# EAGLE design usb-dongle (EAGLE 6.6.0)
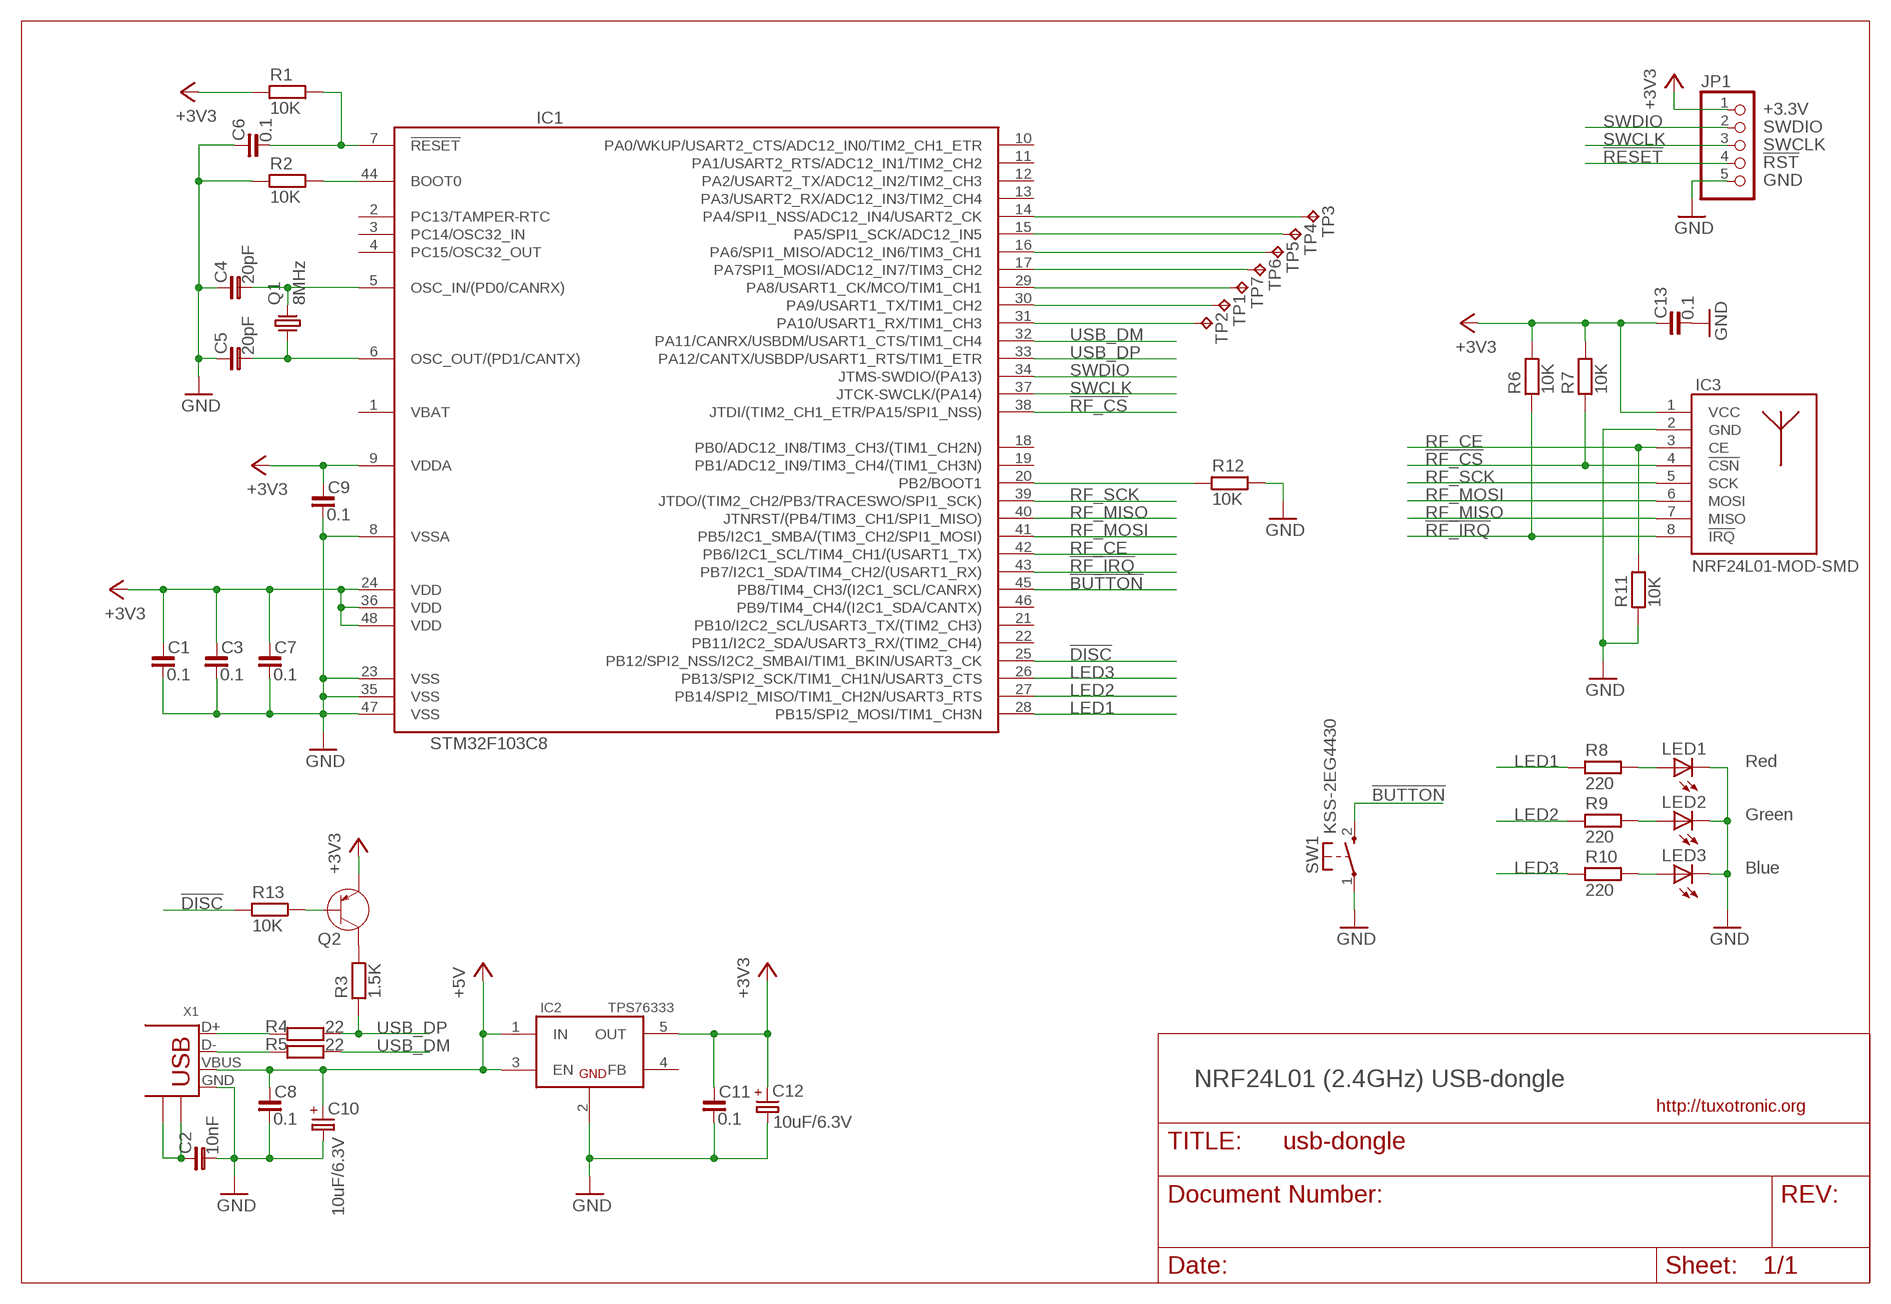
[diagram p0: schematic, sheet 1]

## Parts
C1  0.1  C_0603  [C0603]
C2  10nF  C_1206  [C1206]
C3  0.1  C_0603  [C0603]
C4  20pF  C_0603  [C0603]
C5  20pF  C_0603  [C0603]
C6  0.1  C_0603  [C0603]
C7  0.1  C_0603  [C0603]
C8  0.1  C_0603  [C0603]
C9  0.1  C_0603  [C0603]
C10  10uF/6.3V  CP_SMCB  [SMC_B]
C11  0.1  C_0603  [C0603]
C12  10uF/6.3V  CP_SMCB  [SMC_B]
C13  0.1  C_0603  [C0603]
IC1  STM32F103C8  [LQFP48]
IC2  TPS76333  [SOT23-5]
IC3  NRF24L01-MOD-SMD  [SMD8-MODULE]
JP1  SWD-5_2.00  [1X05M]
LED1  LEDCHIPLED_0805  [CHIPLED_0805]
LED2  LEDCHIPLED_0805  [CHIPLED_0805]
LED3  LEDCHIPLED_0805  [CHIPLED_0805]
Q1  8MHz  CRYSTAL-HC49S  [HC49/S]
Q2  PNP-SOT23  [SOT23]
R1  10K  R_0603  [R0603]
R2  10K  R_0603  [R0603]
R3  1.5K  R_0603  [R0603]
R4  22  R_0603  [R0603]
R5  22  R_0603  [R0603]
R6  10K  R_0603  [R0603]
R7  10K  R_0603  [R0603]
R8  220  R_0603  [R0603]
R9  220  R_0603  [R0603]
R10  220  R_0603  [R0603]
R11  10K  R_0603  [R0603]
R12  10K  R_0603  [R0603]
R13  10K  R_0603  [R0603]
SW1  KSS-2EG4430  [KSS-2EG4430]
TP1  TPB1,27  [B1,27]
TP2  TPB1,27  [B1,27]
TP3  TPB1,27  [B1,27]
TP4  TPB1,27  [B1,27]
TP5  TPB1,27  [B1,27]
TP6  TPB1,27  [B1,27]
TP7  TPB1,27  [B1,27]
X1  USB-MALE-A-H  [USB-A-MH]

## Nets
!BUTTON: IC1.45(PB8/TIM4_CH3/(I2C1_SCL/CANRX)) SW1.2(S)
!DISC: IC1.25(PB12/SPI2_NSS/I2C2_SMBAI/TIM1_BKIN/USART3_CK) R13.1
!RESET: C6.2 IC1.7(!RESET) JP1.4 R1.2
!RF_CS: IC1.38(JTDI/(TIM2_CH1_ETR/PA15/SPI1_NSS)) IC3.4(!CSN) R7.1
!RF_IRQ: IC1.43(PB7/I2C1_SDA/TIM4_CH2/(USART1_RX)) IC3.8(!IRQ) R6.1
+3V3: C1.1 C3.1 C7.1 C9.1 C11.1 C12.+ C13.1 IC1.9(VDDA) IC1.24(VDD) IC1.36(VDD) IC1.48(VDD) IC2.5(OUT) IC3.1(VCC) JP1.1 Q2.2(E) R1.1 R6.2 R7.2
+5V: C8.1 C10.+ IC2.1(IN) IC2.3(EN) X1.VBUS
GND: C1.2 C2.2 C3.2 C4.1 C5.1 C6.1 C7.2 C8.2 C9.2 C10.- C11.2 C12.- C13.2 IC1.8(VSSA) IC1.23(VSS) IC1.35(VSS) IC1.47(VSS) IC2.2(GND) IC3.2(GND) JP1.5 LED1.C LED2.C LED3.C R2.1 R11.1 R12.2 SW1.1(P) X1.GND
LED1: IC1.28(PB15/SPI2_MOSI/TIM1_CH3N) R8.1
LED2: IC1.27(PB14/SPI2_MISO/TIM1_CH2N/USART3_RTS) R9.1
LED3: IC1.26(PB13/SPI2_SCK/TIM1_CH1N/USART3_CTS) R10.1
N$1: C2.1 X1.P$5 X1.P$6
N$2: R4.1 X1.D+
N$3: R5.1 X1.D-
N$4: IC1.30(PA9/USART1_TX/TIM1_CH2) TP1.PP(TP)
N$5: IC1.31(PA10/USART1_RX/TIM1_CH3) TP2.PP(TP)
N$6: C4.2 IC1.5(OSC_IN/(PD0/CANRX)) Q1.2
N$7: C5.2 IC1.6(OSC_OUT/(PD1/CANTX)) Q1.1
N$8: LED1.A R8.2
N$9: LED2.A R9.2
N$10: LED3.A R10.2
N$11: IC1.44(BOOT0) R2.2
N$12: IC1.14(PA4/SPI1_NSS/ADC12_IN4/USART2_CK) TP3.PP(TP)
N$13: IC1.15(PA5/SPI1_SCK/ADC12_IN5) TP4.PP(TP)
N$14: IC1.16(PA6/SPI1_MISO/ADC12_IN6/TIM3_CH1) TP5.PP(TP)
N$15: IC1.17(PA7SPI1_MOSI/ADC12_IN7/TIM3_CH2) TP6.PP(TP)
N$16: IC1.29(PA8/USART1_CK/MCO/TIM1_CH1) TP7.PP(TP)
N$17: IC1.20(PB2/BOOT1) R12.1
N$18: Q2.1(B) R13.2
N$19: Q2.3(C) R3.2
RF_CE: IC1.42(PB6/I2C1_SCL/TIM4_CH1/(USART1_TX)) IC3.3(CE) R11.2
RF_MISO: IC1.40(JTNRST/(PB4/TIM3_CH1/SPI1_MISO)) IC3.7(MISO)
RF_MOSI: IC1.41(PB5/I2C1_SMBA/(TIM3_CH2/SPI1_MOSI)) IC3.6(MOSI)
RF_SCK: IC1.39(JTDO/(TIM2_CH2/PB3/TRACESWO/SPI1_SCK)) IC3.5(SCK)
SWCLK: IC1.37(JTCK-SWCLK/(PA14)) JP1.3
SWDIO: IC1.34(JTMS-SWDIO/(PA13)) JP1.2
USB_DM: IC1.32(PA11/CANRX/USBDM/USART1_CTS/TIM1_CH4) R5.2
USB_DP: IC1.33(PA12/CANTX/USBDP/USART1_RTS/TIM1_ETR) R3.1 R4.2
Unconnected: IC1.2(PC13/TAMPER-RTC) IC1.3(PC14/OSC32_IN) IC1.4(PC15/OSC32_OUT) IC1.10(PA0/WKUP/USART2_CTS/ADC12_IN0/TIM2_CH1_ETR) IC1.11(PA1/USART2_RTS/ADC12_IN1/TIM2_CH2) IC1.12(PA2/USART2_TX/ADC12_IN2/TIM2_CH3) IC1.13(PA3/USART2_RX/ADC12_IN3/TIM2_CH4) IC1.18(PB0/ADC12_IN8/TIM3_CH3/(TIM1_CH2N)) IC1.19(PB1/ADC12_IN9/TIM3_CH4/(TIM1_CH3N)) IC1.21(PB10/I2C2_SCL/USART3_TX/(TIM2_CH3)) IC1.22(PB11/I2C2_SDA/USART3_RX/(TIM2_CH4)) IC1.46(PB9/TIM4_CH4/(I2C1_SDA/CANTX)) IC2.4(FB)

## Notes on the sheet
- Red
- Green
- Blue
- NRF24L01 (2.4GHz) USB-dongle

## Power pins joined to a net without a drawn wire
VBAT: IC1.1(VBAT)

## Library data of the parts
C1-C9 C11 C13 = rc-master-smd:C_: NON-POLARIZED CAP
C10 C12 = rc-master-smd:CP_: POLARIZED CAP
IC1 = stm32:STM32F103C
IC2 = vreg-linear:TPS763: TPS763xx: Low-Power 150-mA Low-Dropout Linear Regulators
IC3 = nrf24l01:NRF24L01-MOD: NRF24L01 based module VCC = 1.9~3.6V
JP1 = jtag:SWD-5: PIN HEADER
LED1-LED3 = led:LED: LED OSRAM: - CHIPLED LG R971, LG N971, LY N971, LG Q971, LY Q971, LO R971, LY R971 LH N974, LH R974 LS Q976, LO Q976, LY Q976 LO Q996 - Hyper CHIPLED LW Q18S LB Q993, LB Q99A, LB R99A - SideLED LS A670, LO A670, LY A670, LG A670, LP A670 LB A673, LV A673, LT A673, LW A673 LH A674 LY A675 LS A676, LA A676, LO A676, LY A676, LW A676 LS A679, LY A679, LG A679 - Hyper Micro SIDELED® LS Y876, LA Y876, LO Y876, LY Y876 LT Y87S - SmartLED LW L88C, LW L88S LB L89C, LB L89S, LG L890 LS L89K, LO L89K, LY L89K LS L896, LA L896, LO L896, LY L896 - TOPLED LS T670, LO T670, LY T670, LG T670, LP T670 LSG T670, LSP T670, LSY T670, LOP T670, LYG T670 LG T671, LOG T671, LSG T671 LB T673, LV T673, LT T673, LW T673 LH T674 LS T676, LA T676, LO T676, LY T676, LB T676, LH T676, LSB T676, LW T676 LB T67C, LV T67C, LT T67C, LS T67K, LO T67K, LY T67K, LW E67C LS E67B, LA E67B, LO E67B, LY E67B, LB E67C, LV E67C, LT E67C LW T67C LS T679, LY T679, LG T679 LS T770, LO T770, LY T770, LG T770, LP T770 LB T773, LV T773, LT T773, LW T773 LH T774 LS E675, LA E675, LY E675, LS T675 LS T776, LA T776, LO T776, LY T776, LB T776 LHGB T686 LT T68C, LB T68C - Hyper Mini TOPLED® LB M676 - Mini TOPLED Santana® LG M470 LS M47K, LO M47K, LY M47K Source: http://www.osram.convergy.de - LUMILED® LXK2-PW12-R00, LXK2-PW12-S00, LXK2-PW14-U00, LXK2-PW14-V00 LXK2-PM12-R00, LXK2-PM12-S00, LXK2-PM14-U00 LXK2-PE12-Q00, LXK2-PE12-R00, LXK2-PE12-S00, LXK2-PE14-T00, LXK2-PE14-U00 LXK2-PB12-K00, LXK2-PB12-L00, LXK2-PB12-M00, LXK2-PB14-N00, LXK2-PB14-P00, LXK2-PB14-Q00 LXK2-PR12-L00, LXK2-PR12-M00, LXK2-PR14-Q00, LXK2-PR14-R00 LXK2-PD12-Q00, LXK2-PD12-R00, LXK2-PD12-S00 LXK2-PH12-R00, LXK2-PH12-S00 LXK2-PL12-P00, LXK2-PL12-Q00, LXK2-PL12-R00 Source: www.luxeon.com
Q1 = crystal:CRYSTAL-: CRYSTAL
Q2 = semiconductor:PNP-
R1-R13 = rc-master-smd:R_: RESISTOR
SW1 = buttons:KSS-2EG4430: Size: 3x6mm Height: 5mm from PCB Rating: DC12v 50mA Travel: 0.25±0.10mm Operating Force: 180±50gf Return Force: 60gf min Contact resistance: 100m? max Insulation resistance: 100M? min Operating life?50,000 cycles
TP1-TP7 = testpad:TP: Test pad
X1 = usb:USB-MALE

## Board
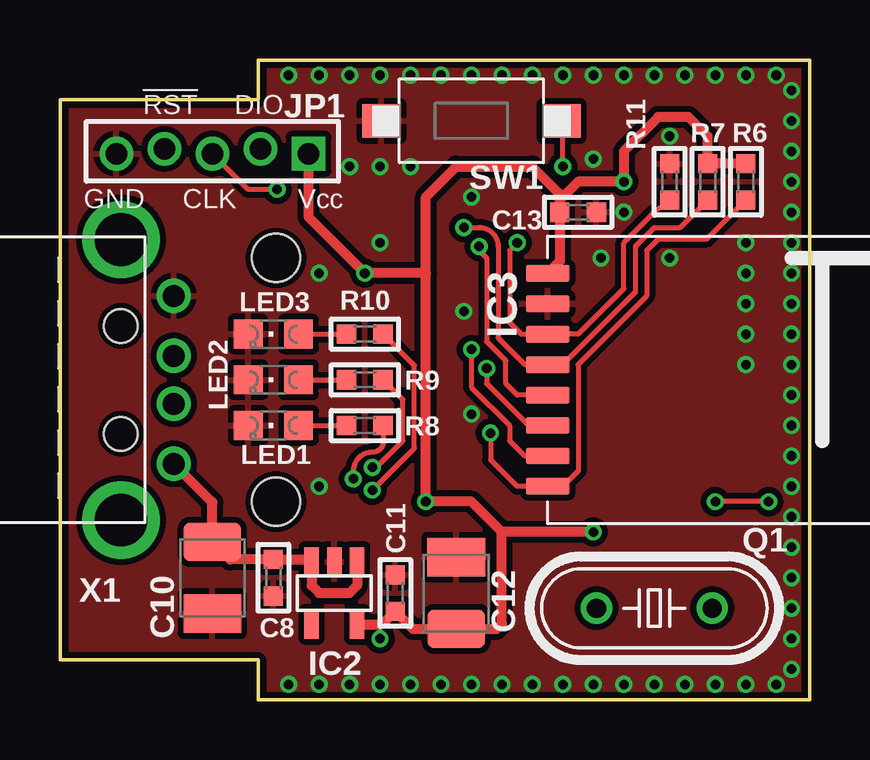
[diagram p1: board, top side]
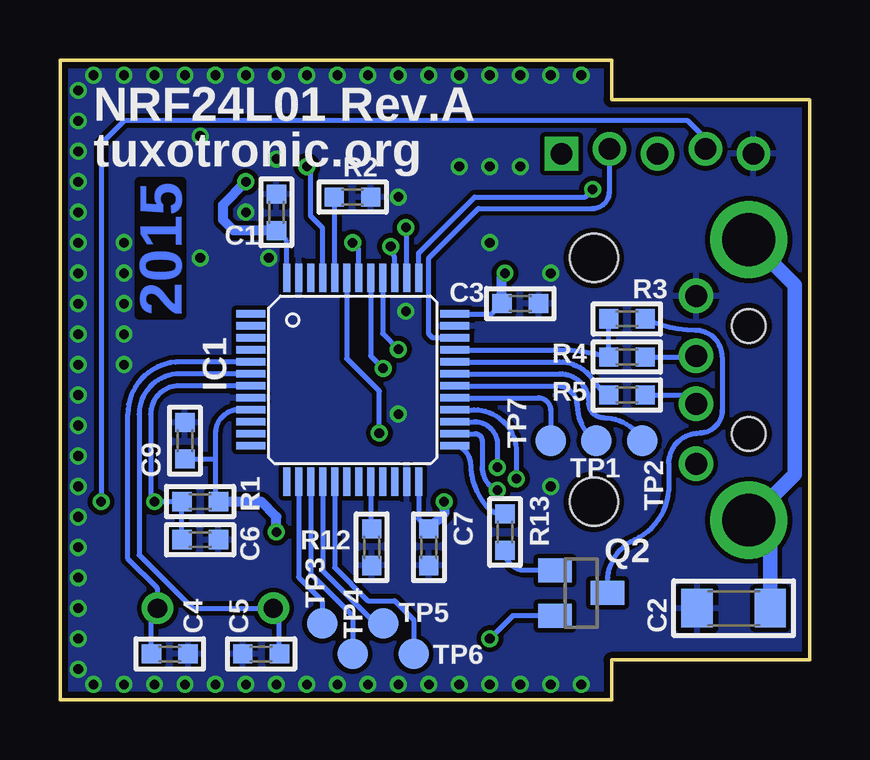
[diagram p2: board, bottom side, seen from below]

Size 31.24 x 26.67 mm. Coordinates in mm from the lower left corner, seen from the top.
Outline: 8.26,0 31.24,0 31.24,26.67 8.26,26.67 8.26,25.02 0,25.02 0,1.65 8.26,1.65 8.26,0
Copper layers (1*16): Top 0.035mm / dielectric 1.5mm / Bottom 0.035mm
Design rules "ITEADstudio_DRC": minimum track width 6mil, minimum drill 12mil, track to track 6mil, track to pad 6mil, pad to pad 6mil, via to via 6mil, smd to smd 0mil, copper to edge 10mil, drill to drill 10mil, minimum pad ring 10mil, minimum via ring 6mil, stop-mask expansion 2mil, vias tented up to drill 100mil, thermal gap 10mil
Holes 2 mm at 9,18.41 9,8.26

### Footprints (pad centres in the part's own frame; a part is rotated, then mirrored left to right if it is on the bottom)
C0603 = smd 0.8 x 0.8: 1 -0.762,0; 2 0.762,0
C1206 = smd 1.3 x 1.6: 1 -1.524,0; 2 1.524,0
SMC_B = smd 1.6 x 2.4: + -1.5,0; - 1.5,0
LQFP48 = smd 0.3 x 1.2: 1 -2.75,-4.25; 2 -2.25,-4.25; 3 -1.75,-4.25; 4 -1.25,-4.25; 5 -0.75,-4.25; 6 -0.25,-4.25; 7 0.25,-4.25; 8 0.75,-4.25; 9 1.25,-4.25; 10 1.75,-4.25; 11 2.25,-4.25; 12 2.75,-4.25; 25 2.75,4.25; 26 2.25,4.25; 27 1.75,4.25; 28 1.25,4.25; 29 0.75,4.25; 30 0.25,4.25; 31 -0.25,4.25; 32 -0.75,4.25; 33 -1.25,4.25; 34 -1.75,4.25; 35 -2.25,4.25; 36 -2.75,4.25 | smd 1.2 x 0.3: 13 4.25,-2.75; 14 4.25,-2.25; 15 4.25,-1.75; 16 4.25,-1.25; 17 4.25,-0.75; 18 4.25,-0.25; 19 4.25,0.25; 20 4.25,0.75; 21 4.25,1.25; 22 4.25,1.75; 23 4.25,2.25; 24 4.25,2.75; 37 -4.25,2.75; 38 -4.25,2.25; 39 -4.25,1.75; 40 -4.25,1.25; 41 -4.25,0.75; 42 -4.25,0.25; 43 -4.25,-0.25; 44 -4.25,-0.75; 45 -4.25,-1.25; 46 -4.25,-1.75; 47 -4.25,-2.25; 48 -4.25,-2.75
SOT23-5 = smd 0.6 x 1.2: 1 -0.95,-1.306; 2 0,-1.306; 3 0.95,-1.306; 4 0.95,1.306; 5 -0.95,1.306
SMD8-MODULE = smd 0.7 x 1.8: 1 -4.445,0; 2 -3.175,0; 3 -1.905,0; 4 -0.635,0; 5 0.635,0; 6 1.905,0; 7 3.175,0; 8 4.445,0
1X05M = drill 0.9 square: 1 -4,0.102 | drill 0.9: 2 -2,-0.102; 3 0,0.102; 4 2,-0.102; 5 4,0.102
CHIPLED_0805 = smd 1.2 x 1.2: A 0,-1.05; C 0,1.05
HC49/S = drill 0.8: 1 -2.413,0; 2 2.413,0
SOT23 = smd 1 x 1.4: 1 -0.95,-1.1; 2 0.95,-1.1; 3 0,1.1
R0603 = smd 0.8 x 0.8: 1 -0.762,0; 2 0.762,0
KSS-2EG4430 = smd 1.6 x 1.4: 1 -3.75,0; 2 3.75,0
B1,27 = smd 1.27 x 1.27: PP 0,0
USB-A-MH = drill 0.92: D+ 2.2,1; D- 2.2,-1; GND 2.2,3.5; VBUS 2.2,-3.5 | drill 2.2: P$5 0,-5.85; P$6 0,5.85 | hole 1.4: 0,2.25; 0,-2.25

### Placement (x,y rotation side)
C1  22.23,20.32 90 bottom
C2  3.17,3.81 180 bottom
C3  12.06,16.51 0 bottom
C4  26.67,1.91 180 bottom
C5  22.86,1.91 0 bottom
C6  25.4,6.67 180 bottom
C7  15.88,6.35 270 bottom
C8  8.89,5.08 270 top
C9  26.04,10.79 90 bottom
C10  6.35,5.08 270 top
C11  13.97,4.45 90 top
C12  16.51,4.45 90 top
C13  21.59,20.32 0 top
IC1  19.05,13.34 270 bottom
IC2  11.43,4.45 180 top
IC3  20.32,13.34 270 top
JP1  6.35,22.86 180 top
LED1  8.89,11.43 90 top
LED2  8.89,13.34 90 top
LED3  8.89,15.24 90 top
Q1  24.77,3.81 0 top
Q2  9.53,4.45 270 bottom
R1  25.4,8.26 180 bottom
R2  19.05,20.95 180 bottom
R3  7.62,15.88 0 bottom
R4  7.62,14.29 180 bottom
R5  7.62,12.7 180 bottom
R6  28.57,21.59 90 top
R7  26.99,21.59 90 top
R8  12.7,11.43 180 top
R9  12.7,13.34 180 top
R10  12.7,15.24 180 top
R11  25.4,21.59 270 top
R12  18.26,6.35 270 bottom
R13  12.7,6.99 270 bottom
SW1  17.14,24.13 0 top
TP1  8.89,10.79 0 bottom
TP2  6.99,10.79 180 bottom
TP3  20.32,3.17 0 bottom
TP4  19.05,1.91 0 bottom
TP5  17.78,3.17 0 bottom
TP6  16.51,1.91 180 bottom
TP7  10.79,10.79 0 bottom
X1  2.54,13.34 0 top

### Tracks (layer width: path | path; a pad name or v marks a point on that pad's centre or on a via)
!BUTTON  (via drill 0.4)
  Top 0.2: v20.95,22.23 20.95,24.07 SW1.2
  Bottom 0.2: IC1.45 20.3,19.66 20.8,20.16 20.8,22.07 v20.95,22.23
!DISC
  Bottom 0.2: R13.1 arc55 13.34,7.94 arc46 14.13,9.81 arc-82 IC1.25
!RESET  (via drill 0.4)
  Top 0.2: v29.53,8.26 v27.3,8.26
  Bottom 0.2: IC1.7 26.29,13.09 arc-90 27.46,11.91 27.46,8.41 v27.3,8.26 R1.2 C6.2 | JP1.4 4.35,23.4 5.08,24.13 28.57,24.13 29.53,23.18 v29.53,8.26
!RF_CS  (via drill 0.4)
  Top 0.2: v16.83,19.68 17.46,19.68 arc-90 18.26,18.89 18.26,15.08 19.37,13.97 IC3.4 20.95,13.97 23.97,16.99 23.97,18.89 24.77,19.68 25.84,19.68 R7.1
  Bottom 0.2: IC1.38 16.8,19.34 v16.83,19.68
!RF_IRQ  (via drill 0.4)
  Top 0.2: v17.94,11.11 17.94,10 19.05,8.89 IC3.8 20.95,8.89 21.59,9.53 21.59,13.97 24.45,16.83 24.45,18.73 24.92,19.21 26.96,19.21 R6.1
  Bottom 0.2: IC1.43 19.3,14.22 17.94,12.86 v17.94,11.11
+3V3  (via drill 0.4)
  Top 0.2: v13.34,2.54 13.34,3.05 13.43,3.14
  Top 0.406: IC2.5 13.43,3.14 C11.1 14.71,2.94 C12.+ 18.18,2.94 18.41,3.17 18.41,6.99 | IC3.1 20.83,18.29 C13.1 20.83,20.83 | R6.2 R7.2 26.99,23.5 26.19,24.29 24.92,24.29 23.5,22.86 v23.5,21.59 21.59,21.59 20.83,20.83 | 18.41,6.99 17.14,8.26 v15.24,8.26 15.24,17.78 | 15.24,17.78 v12.7,17.78 10.35,20.13 JP1.1 | 15.24,17.78 15.24,20.95 16.51,22.23 19.68,22.23 20.83,21.08 20.83,20.83 | v22.23,6.99 18.41,6.99
  Bottom 0.2: IC1.9 23.79,12.09 arc-90 24.77,11.11 24.77,10 | 24.77,10 24.77,8.38 R1.1 | C9.1 24.8,10.03 24.77,10 | IC1.48 21.8,19.13 C1.1 | IC1.36 13.25,16.09 C3.1 | IC1.24 16.3,7.54 C7.1 | Q2.2 12.38,3.5 v13.34,2.54
  Bottom 0.406: C1.1 24,19.56 24.45,20 24.45,20.64 v23.5,21.59 | C3.1 12.83,17.65 v12.7,17.78 | v15.24,8.26 15.24,7.75 C7.1 | R1.1 22.86,8.26 22.23,7.62 v22.23,6.99
+5V
  Top 0.406: X1.VBUS 6.35,8.22 C10.+ 7.09,5.84 C8.1 10.39,5.84 IC2.3 10.48,4.76 10.79,4.45 12.06,4.45 12.38,4.76 IC2.1
GND  (via drill 0.4)
  other vias: 25.4,23.5 17.14,20.95 23.5,20.32 22.23,22.54 22.54,18.41 10.79,17.78 13.34,22.23 17.14,11.91 13.34,19.05 13.34,26.04 12.06,26.04 10.79,26.04 9.53,26.04 14.61,26.04 15.88,26.04 17.14,26.04 18.41,26.04 19.68,26.04 20.95,26.04 22.23,26.04 23.5,26.04 24.77,26.04 26.04,26.04 27.3,26.04 28.57,26.04 29.84,26.04 30.48,25.4 30.48,24.13 30.48,22.86 30.48,21.59 30.48,20.32 30.48,19.05 30.48,17.78 30.48,16.51 30.48,15.24 30.48,13.97 30.48,12.7 30.48,11.43 30.48,10.16 30.48,8.89 30.48,7.62 30.48,6.35 30.48,5.08 30.48,3.81 30.48,2.54 30.48,1.27 29.84,0.64 28.57,0.64 27.3,0.64 26.04,0.64 24.77,0.64 23.5,0.64 22.23,0.64 20.95,0.64 19.68,0.64 18.41,0.64 17.14,0.64 15.88,0.64 14.61,0.64 13.34,0.64 12.06,0.64 10.79,0.64 9.53,0.64 28.57,19.05 28.57,17.78 28.57,16.51 28.57,15.24 28.57,13.97 25.4,18.41 12.06,22.23 14.61,22.23 16.83,16.19 10.79,8.89
  pour Top (isolate 0.254, rank 6): -0.64,27.3 31.75,27.3 31.75,-0.64 -0.64,-0.64
  pour Bottom (isolate 0.2, rank 6): -1.27,27.94 32.38,27.94 32.38,-1.27 -1.27,-1.27
LED1  (via drill 0.4)
  Top 0.2: R8.1 arc-6 13.49,10.79 arc-90 13.02,10.32 arc90 12.22,9.53 v12.22,9.21
  Bottom 0.2: IC1.28 13.99,12.09 arc90 12.22,10.32 v12.22,9.21
LED2  (via drill 0.4)
  Top 0.2: v13.02,9.68 13.18,9.68 14.29,10.79 14.29,12.51 R9.1
  Bottom 0.2: IC1.27 13.97,11.59 arc90 13.02,10.64 v13.02,9.68
LED3  (via drill 0.4)
  Top 0.2: v13.02,8.73 14.76,10.48 14.76,13.94 R10.1
  Bottom 0.2: IC1.26 13.94,11.09 arc90 13.65,10.79 13.65,9.68 arc-67 v13.02,8.73
N$1
  Bottom 0.61: X1.P$6 0.64,17.28 0.64,9.39 X1.P$5 1.65,6.6 C2.1
N$2
  Bottom 0.2: R4.1 4.79,14.29 X1.D+
N$3
  Bottom 0.2: R5.1 5.11,12.7 X1.D-
N$4
  Bottom 0.2: IC1.30 10.64,13.09 arc96 9.68,12.22 arc-58 TP1.PP
N$5
  Bottom 0.2: IC1.31 10.41,13.59 arc90 9.21,12.38 arc-90 8.57,11.75 arc62 TP2.PP
N$6
  Bottom 0.2: IC1.5 26.24,14.09 arc-90 28.42,11.91 28.42,5.87 27.18,4.64 Q1.2 27.43,3.56 C4.2
N$7
  Bottom 0.2: IC1.6 26.26,13.59 arc-90 27.94,11.91 27.94,6.03 25.72,3.81 Q1.1 22.1,3.56 C5.2
N$8
  Top 0.2: LED1.A R8.2
N$9
  Top 0.2: LED2.A R9.2
N$10
  Top 0.2: LED3.A R10.2
N$11
  Bottom 0.2: IC1.44 R2.2
N$12
  Bottom 0.2: IC1.14 21.3,5.11 20.32,4.13 TP3.PP
N$13
  Bottom 0.2: IC1.15 20.8,5.24 19.05,3.49 TP4.PP
N$14
  Bottom 0.2: IC1.16 20.3,5.38 18.1,3.17 TP5.PP
N$15
  Bottom 0.2: IC1.17 19.8,5.51 18.41,4.13 17.3,4.13 16.51,3.33 TP6.PP
N$16
  Bottom 0.2: IC1.29 11.31,12.59 arc90 10.79,12.06 TP7.PP
N$17
  Bottom 0.2: IC1.20 18.3,7.16 R12.1
N$18
  Bottom 0.2: Q2.1 11.87,5.39 arc90 R13.2
N$19
  Bottom 0.2: Q2.3 8.43,4.91 arc65 7.3,6.67 arc-61 5.87,8.73 5.87,9.84 arc90 4.6,11.11 arc-90 3.65,12.06 3.65,14.29 arc-90 4.76,15.4 arc26 R3.2
RF_CE  (via drill 0.4)
  Top 0.2: v19.05,19.05 18.73,18.73 18.73,15.72 19.21,15.24 IC3.3 21.59,15.24 23.5,17.14 23.5,19.05 24.77,20.32 R11.2
  Bottom 0.2: IC1.42 18.8,18.8 v19.05,19.05
RF_MISO  (via drill 0.4)
  Top 0.2: v17.14,14.61 17.14,13.02 18.73,11.43 18.73,10.79 19.37,10.16 IC3.7
  Bottom 0.2: IC1.40 17.8,15.26 v17.14,14.61
RF_MOSI  (via drill 0.4)
  Top 0.2: IC3.6 19.53,11.43 17.78,13.18 v17.78,13.81
  Bottom 0.2: IC1.41 18.3,14.33 v17.78,13.81
RF_SCK  (via drill 0.4)
  Top 0.2: IC3.5 19.05,12.7 18.57,13.18 18.57,14.13 17.78,14.92 17.78,18.41 17.46,18.73 v17.46,18.89
  Bottom 0.2: IC1.39 17.3,18.41 v17.46,18.89
SWCLK  (via drill 0.4)
  Top 0.2: v9.05,21.27 7.84,21.27 JP1.3
  Bottom 0.2: v9.05,21.27 9.37,20.95 13.97,20.95 16.3,18.62 IC1.37
SWDIO
  Bottom 0.2: IC1.34 15.72,15.09 15.88,15.24 15.88,18.41 13.81,20.48 9.05,20.48 arc-90 8.35,21.18 JP1.2
USB_DM
  Bottom 0.2: IC1.32 10.43,14.09 arc57 9.05,13.34 arc-27 R5.2
USB_DP
  Bottom 0.2: IC1.33 10.46,14.59 arc16 R4.2 R3.1

### Text on the board
Bottom: 2015
bPlace: NRF24L01 Rev.A | tuxotronic.org